# EAGLE schematic RPiProject (EAGLE 7.3.0)
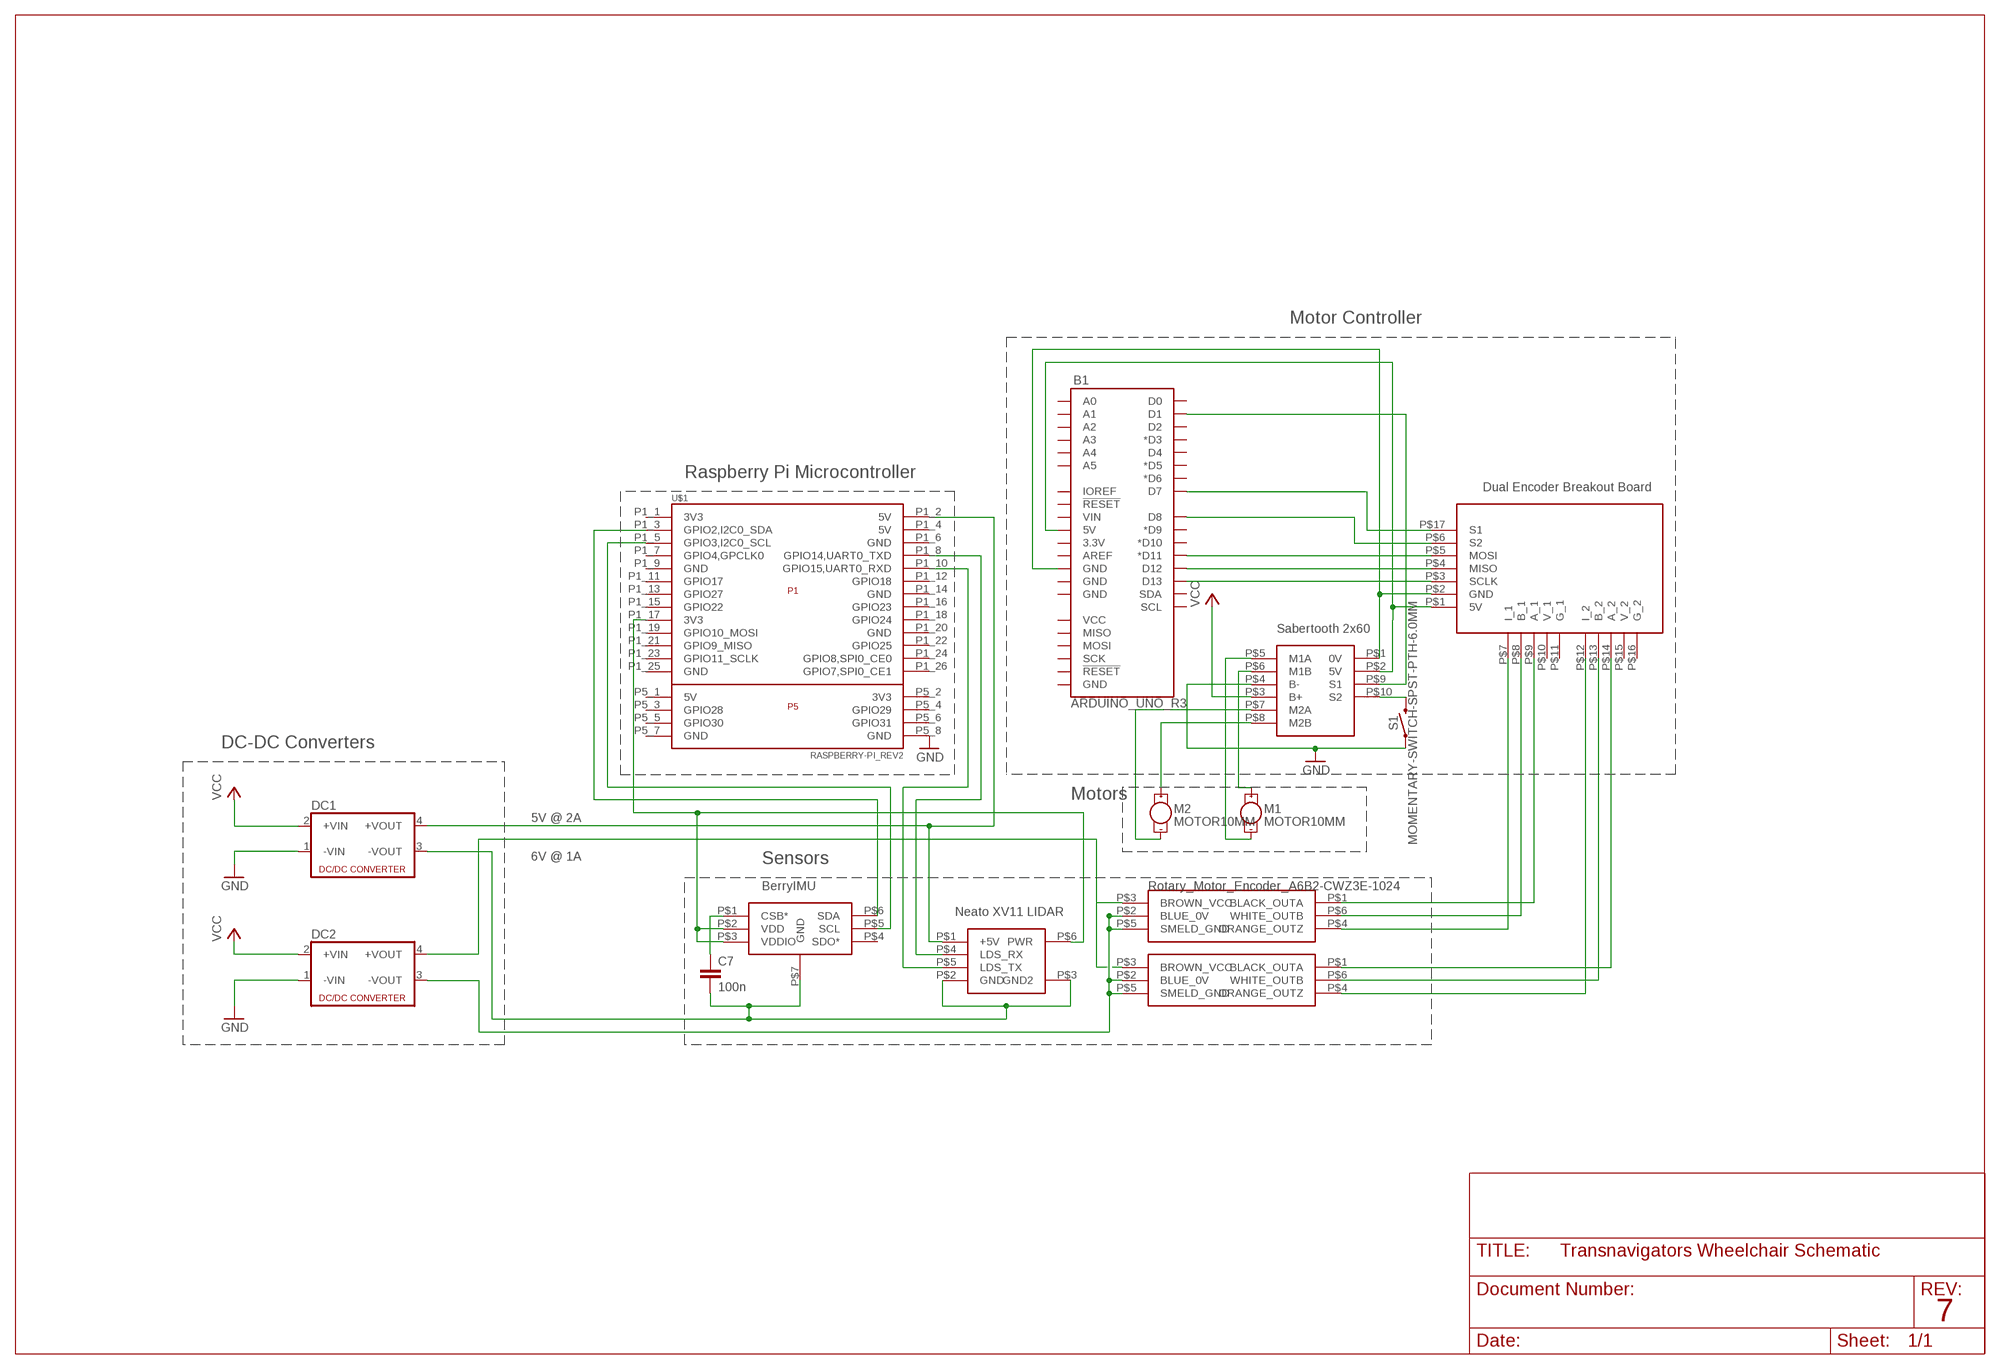
[diagram p0: schematic, sheet 1]

## Parts
B1  ARDUINO_UNO_R3  [ARDUINO_R3]
C7  100n  C2.5P  [C025-030X050]
DC1  NME  [NME]
DC2  NME  [NME]
M1  MOTOR10MM  [VIBE-MOTOR-10MM]
M2  MOTOR10MM  [VIBE-MOTOR-10MM]
S1  MOMENTARY-SWITCH-SPST-PTH-6.0MM  [TACTILE_SWITCH_PTH_6.0MM]
U$1  RASPBERRY-PI_REV2  [RASPBERRY-PI_REV2]
U$2  ENCODER_A6B2  [ENCODER_A6B2]
U$3  ENCODER_A6B2  [ENCODER_A6B2]
U$4  BERRYIMU  [BERRYIMU]
U$5  DUAL_LS7366R  [DUAL_LS7366R]
U$6  SABERTOOTH2X60  [SABERTOOTH2X60]
XV11LIDAR  XV11LIDAR  [LIDAR]

## Nets
GND: DC1.1(-VIN) DC2.1(-VIN) S1.1 U$1.P5_8(GND) U$6.P$4(B-)
N$1: M2.- U$6.P$7(M2A)
N$2: DC1.4(+VOUT) U$1.P1_2(5V) XV11LIDAR.P$1(+5V)
N$3: B1.D1 U$6.P$9(S1)
N$4: U$2.P$3(BROWN_VCC)
N$5: U$1.P1_17(3V3) U$4.P$2(VDD) U$4.P$3(VDDIO) XV11LIDAR.P$6(PWR)
N$6: C7.1 U$4.P$1(CSB*)
N$7: M2.+ U$6.P$8(M2B)
N$8: M1.- U$6.P$5(M1A)
N$9: DC2.4(+VOUT) U$3.P$3(BROWN_VCC)
N$10: U$1.P1_8(GPIO14,UART0_TXD) XV11LIDAR.P$4(LDS_RX)
N$11: U$2.P$1(BLACK_OUTA) U$5.P$9(A_1)
N$12: U$1.P1_5(GPIO3,I2C0_SCL) U$4.P$5(SCL)
N$13: M1.+ U$6.P$6(M1B)
N$14: B1.5V U$5.P$1(5V) U$6.P$2(5V)
N$15: U$1.P1_3(GPIO2,I2C0_SDA) U$4.P$6(SDA)
N$16: B1.GND@4(GND) U$5.P$2(GND) U$6.P$1(0V)
N$17: S1.3 U$6.P$10(S2)
N$18: C7.2 DC1.3(-VOUT) U$4.P$7(GND) XV11LIDAR.P$2(GND) XV11LIDAR.P$3(GND2)
N$19: U$3.P$1(BLACK_OUTA) U$5.P$14(A_2)
N$20: DC2.3(-VOUT) U$2.P$2(BLUE_0V) U$2.P$5(SMELD_GND) U$3.P$2(BLUE_0V) U$3.P$5(SMELD_GND)
N$21: U$3.P$6(WHITE_OUTB) U$5.P$13(B_2)
N$22: U$2.P$6(WHITE_OUTB) U$5.P$8(B_1)
N$23: B1.D13 U$5.P$3(SCLK)
N$24: U$2.P$4(ORANGE_OUTZ) U$5.P$7(I_1)
N$25: U$3.P$4(ORANGE_OUTZ) U$5.P$12(I_2)
N$26: U$1.P1_10(GPIO15,UART0_RXD) XV11LIDAR.P$5(LDS_TX)
N$27: B1.D12 U$5.P$4(MISO)
N$28: B1.D11(*D11) U$5.P$5(MOSI)
N$29: B1.D7 U$5.P$17(S1)
N$30: B1.D8 U$5.P$6(S2)
VCC: DC1.2(+VIN) DC2.2(+VIN) U$6.P$3(B+)
Unconnected: B1.3.3V B1.A0 B1.A1 B1.A2 B1.A3 B1.A4 B1.A5 B1.AREF B1.D0 B1.D2 B1.D3(*D3) B1.D4 B1.D5(*D5) B1.D6(*D6) B1.D9(*D9) B1.D10(*D10) B1.GND@1(GND) B1.GND@2(GND) B1.GND@3(GND) B1.IOREF B1.MISO B1.MOSI B1.RESET@1(!RESET!) B1.RESET@2(!RESET!) B1.SCK B1.SCL B1.SDA B1.VCC B1.VIN U$1.P1_1(3V3) U$1.P1_4(5V) U$1.P1_6(GND) U$1.P1_7(GPIO4,GPCLK0) U$1.P1_9(GND) U$1.P1_11(GPIO17) U$1.P1_12(GPIO18) U$1.P1_13(GPIO27) U$1.P1_14(GND) U$1.P1_15(GPIO22) U$1.P1_16(GPIO23) U$1.P1_18(GPIO24) U$1.P1_19(GPIO10_MOSI) U$1.P1_20(GND) U$1.P1_21(GPIO9_MISO) U$1.P1_22(GPIO25) U$1.P1_23(GPIO11_SCLK) U$1.P1_24(GPIO8,SPI0_CE0) U$1.P1_25(GND) U$1.P1_26(GPIO7,SPI0_CE1) U$1.P5_1(5V) U$1.P5_2(3V3) U$1.P5_3(GPIO28) U$1.P5_4(GPIO29) U$1.P5_5(GPIO30) U$1.P5_6(GPIO31) U$1.P5_7(GND) U$4.P$4(SDO*) U$5.P$10(V_1) U$5.P$11(G_1) U$5.P$15(V_2) U$5.P$16(G_2)

## Notes on the sheet
- Motor Controller
- Raspberry Pi Microcontroller
- Dual Encoder Breakout Board
- Sabertooth 2x60
- DC-DC Converters
- Motors
- 5V @ 2A
- 6V @ 1A
- Sensors
- BerryIMU | Rotary_Motor_Encoder_A6B2-CWZ3E-1024
- Neato XV11 LIDAR

## Library data of the parts
B1 = SparkFun-Boards:ARDUINO_UNO_R3: Arduino R3 Footprint with SPI header Arduino Uno R3 Compatible Footprint. Matches PCB size of the original board. SparkFun Products: SAMD21 Dev Breakout <https://www.sparkfun.com/products/13672> RedBoard <https://www.sparkfun.com/products/12757> R3 Stackable Headers <https://www.sparkfun.com/products/11417>
C7 = ee2parts:C: Capacitor
DC1 DC2 = dc-dc-converter:NME: DC-DC CONVERTER; MF: C & D TECHNOLOGIES, INC; MPN: NME1205D; OC_FARNELL: 1021466; OC_NEWARK: 98B8198
M1 M2 = SparkFun-Electromechanical:MOTOR: Motor (Single-Phase) Two-terminal, single-phase motors. SparkFun Products Vibration Motor <https://www.sparkfun.com/products/8449> (ROB-08449) Physical dimension and wire connections for this powerful vibration motor. Motor has a self adhesive backing.; PROD_ID: COMP-08572; SF_SKU: ROB-08449
S1 = SparkFun-Switches:MOMENTARY-SWITCH-SPST: Momentary Switch (Pushbutton) - SPST Normally-open (NO) SPST momentary switches (buttons, pushbuttons). Variants PTH-12MM - 12mm square, through-hole Momentary Pushbutton Switch - 12mm Square <https://www.sparkfun.com/products/9190> (COM-09190) PTH-6.0MM, PTH-6.0MM-KIT - 6.0mm square, through-hole Mini Pushbutton Switch <https://www.sparkfun.com/products/97> (COM-00097) KIT package intended for soldering kit's - only one side of pads' copper is exposed. PTH-RIGHT-ANGLE-KIT - Right-angle, through-hole Right Angle Tactile Button <https://www.sparkfun.com/products/10791> - Used on SparkFun BigTime Watch Kit <https://www.sparkfun.com/products/11734> SMD-12MM - 12mm square, surface-mount Tactile Button - SMD (12mm) <https://www.sparkfun.com/products/12993> (COM-12993) Used on SparkFun PicoBoard <https://www.sparkfun.com/products/11888> SMD-4.5MM - 4.5mm Square Trackball Switch Used on SparkFun Blackberry Trackballer Breakout <https://www.sparkfun.com/products/13169> SMD-4.6MMX2.8MM - 4.60mm x 2.80mm, surface mount Used on SparkFun SAMD21 Mini Breakout <https://www.sparkfun.com/products/13664> SMD-5.2MM, SMD-5.2-REDUNDANT - 5.2mm square, surface-mount Mini Pushbutton Switch - SMD <https://www.sparkfun.com/products/8720> (COM-08720) Used on Arduino Pro Mini <https://www.sparkfun.com/products/11114> REDUNDANT package connects both switch circuits together SMD-6.0X3.5MM - 6.0 x 3.5mm, surface mount Momentary Reset Switch SMD <https://www.sparkfun.com/products/8229> (COM-08229) SMD-6.2MM-TALL - 6.2mm square, surface mount Tactile Button - SMD (6mm) <https://www.sparkfun.com/products/12992> Used on SparkFun Digital Sandbox <https://www.sparkfun.com/products/12651> SMD-RIGHT-ANGLE - Right-angle, surface mount Used on SparkFun Block for Intel® Edison - Arduino <https://www.sparkfun.com/products/13036>; PROD_ID: SWCH-08441; SF_SKU: COM-00097
U$1 = RaspberryPi:RASPBERRY-PI_REV2: Raspberry Pi Board <http://www.raspberrypi.org/> Jacques Lagnel V1.0 (beta) 2012 Mateusz Bawaj V1.1 (beta) 2012 Board dimension: Forum 3D model <http://www.raspberrypi.org/forum/general-discussion/mechanical-profile-3d-models?value=3d%20model&type=1&include=1&search=1&ret=all> The GPIO Connector (P1): http://elinux.org/RPi_Low-level_peripherals The GPIO Connector (P5): http://www.raspberrypi-spy.co.uk/2012/09/raspberry-pi-p5-header/
U$2 U$3 = RaspberryPi:ENCODER_A6B2
U$4 = RaspberryPi:BERRYIMU
U$5 = RaspberryPi:DUAL_LS7366R
U$6 = RaspberryPi:SABERTOOTH2X60
XV11LIDAR = RaspberryPi:XV11LIDAR